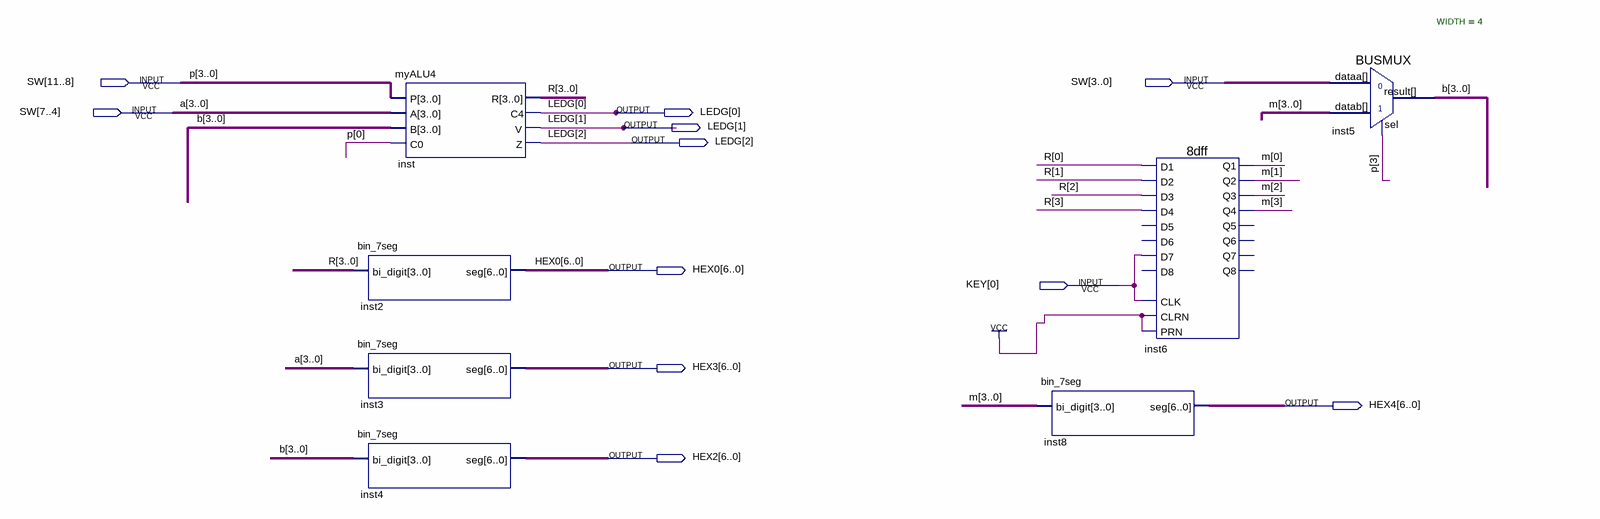
[diagram p0: schematic sheet]
// Quartus schematic Lab6.bdf as structural Verilog: 7 symbols, 11 pins
module Lab6 (
  input  [11:0] SW,
  input  [0:0] KEY,
  output [2:0] LEDG,
  output [6:0] HEX0,
  output [6:0] HEX3,
  output [6:0] HEX4,
  output [6:0] HEX2
);

  wire [3:0] b, m, R;

  bin_7seg inst2 (.bi_digit(R), .seg(HEX0));
  bin_7seg inst3 (.bi_digit(SW[7:4]), .seg(HEX3));
  bin_7seg inst4 (.bi_digit(b), .seg(HEX2));
  myALU4 inst (.P(SW[11:8]), .A(SW[7:4]), .B(b), .C0(SW[8]), .R(R), .C4(LEDG[0]), .V(LEDG[1]), .Z(LEDG[2]));
  bin_7seg inst8 (.bi_digit(m), .seg(HEX4));
  \8dff  inst6 (
    .D4(R[3]), .D3(R[2]), .D7(KEY[0]), .PRN(1'b1), .CLK(KEY[0]), .CLRN(1'b1), .D2(R[1]), .D1(R[0]),
    .Q1(m[0]), .Q4(m[3]), .Q3(m[2]), .Q2(m[1]));  // open: D5, D8, D6, Q8, Q5, Q6, Q7
  BUSMUX #(.WIDTH(4)) inst5 (.datab(m), .sel(SW[11]), .dataa(SW[3:0]), .result(b));

  // Other names for the same wires on the sheet: a[3:0] = SW[7:4]; p[3:0] = SW[11:8]
endmodule
